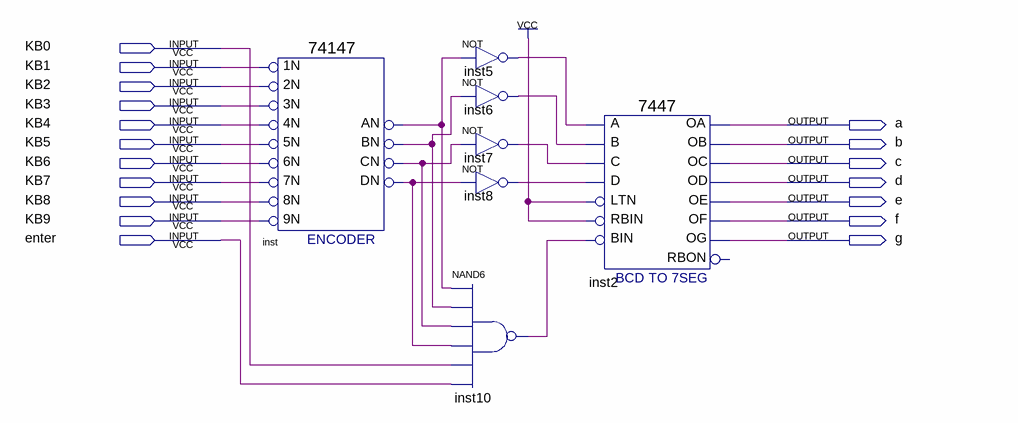
[diagram p0: schematic sheet]
// Quartus schematic circuitosSecuritybox.bdf as structural Verilog: 7 symbols, 18 pins
module circuitosSecuritybox (
  input  KB0,
  input  KB1,
  input  KB2,
  input  KB3,
  input  KB4,
  input  KB5,
  input  KB6,
  input  KB7,
  input  KB8,
  input  KB9,
  input  enter,
  output a,
  output b,
  output c,
  output d,
  output e,
  output f,
  output g
);

  wire inst5_out, inst6_out, inst7_out, inst8_out, inst10_out, inst_an, inst_bn, inst_cn, inst_dn;

  \74147  inst (
    .\1N (KB1), .\2N (KB2), .\3N (KB3), .\6N (KB6), .\5N (KB5), .\4N (KB4), .\9N (KB9), .\8N (KB8),
    .\7N (KB7), .CN(inst_cn), .BN(inst_bn), .AN(inst_an), .DN(inst_dn));
  not inst5 (inst5_out, inst_an);
  not inst6 (inst6_out, inst_bn);
  not inst7 (inst7_out, inst_cn);
  not inst8 (inst8_out, inst_dn);
  nand inst10 (inst10_out, inst_an, inst_bn, inst_cn, inst_dn, KB0, enter);
  \7447  inst2 (
    .LTN(1'b1), .B(inst6_out), .C(inst7_out), .D(inst8_out), .RBIN(1'b1), .BIN(inst10_out), .A(inst5_out),
    .OB(b), .OC(c), .OE(e), .OD(d), .OF(f), .OG(g), .OA(a));  // open: RBON
endmodule
